# EAGLE design LCDv  (EAGLE 6.2)
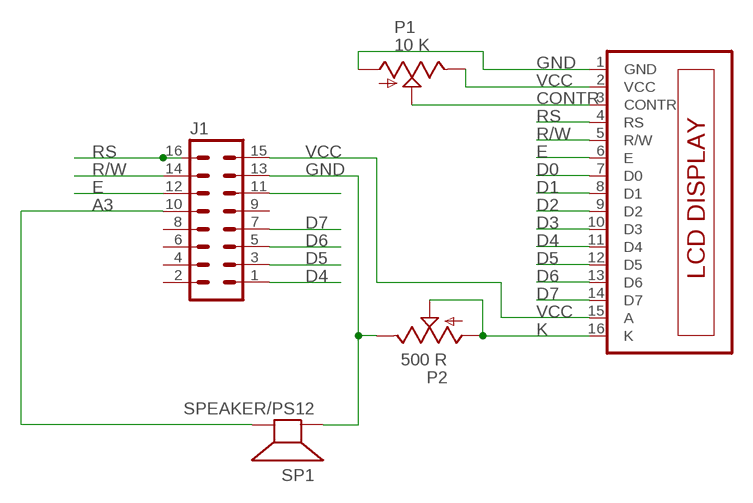
[diagram p0: schematic, sheet 1]

## Parts
J1  ML16L  [ML16L]
LCD1  DISP_LCD-4X20  [DISP_LCD_4X20]
P1  10 K  TRIM  [6MM]
P2  500 R  TRIM  [6MM]
SP1  SPEAKER/PS12  [PS12]

## Nets
A3: J1.10 SP1.P$2(-)
CONTR: LCD1.3(CONTR) P1.S
D0: LCD1.7(D0)
D1: LCD1.8(D1)
D2: LCD1.9(D2)
D3: LCD1.10(D3)
D4: J1.1 LCD1.11(D4)
D5: J1.3 LCD1.12(D5)
D6: J1.5 LCD1.13(D6)
D7: J1.7 LCD1.14(D7)
E: J1.12 LCD1.6(E)
GND: J1.13 LCD1.1(GND) P1.A P2.E SP1.P$1(+)
K: LCD1.16(K) P2.A P2.S
N$3: J1.11
R/W: J1.14 LCD1.5(R/W)
RS: J1.16 LCD1.4(RS)
VCC: J1.15 LCD1.2(VCC) LCD1.15(A) P1.E
Unconnected: J1.2 J1.4 J1.6 J1.8 J1.9

## Library data of the parts
J1 = con-harting-ml:ML16: HARTING; OC_FARNELL: unknown; OC_NEWARK: unknown
LCD1 = dp_devices:DISP_LCD
P1 P2 = adafruit:TRIM
SP1 = adafruit:SPEAKER: SPEAKER Source: Buerklin Added PS12 (for part # PS1240 piezo) http://www.ladyada.net/library/pcb/eaglelibrary.html

## Board
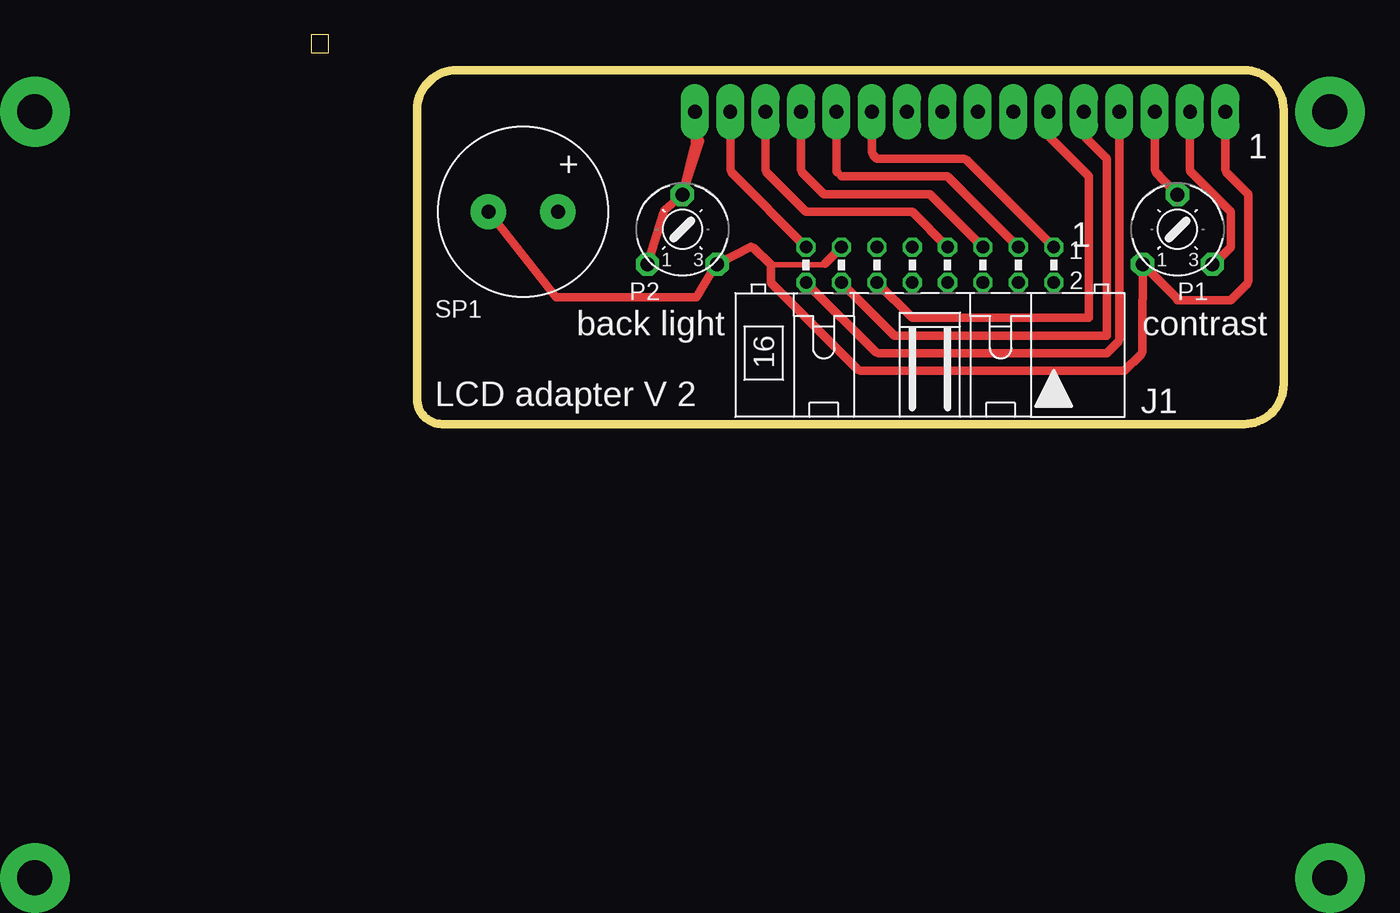
[diagram p1: board, top side]
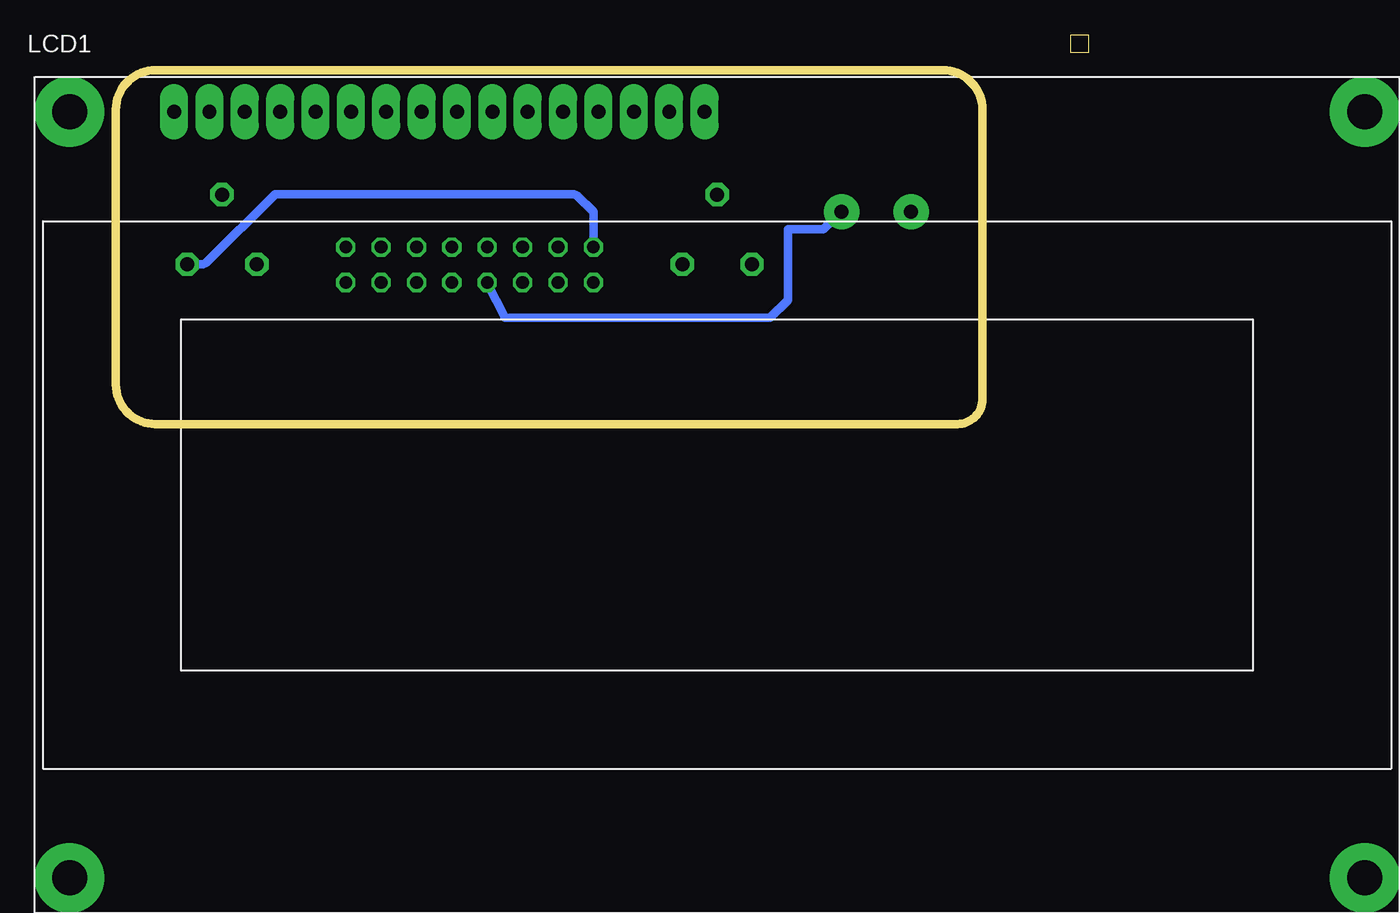
[diagram p2: board, bottom side, seen from below]

Size 69.85 x 27.94 mm. Coordinates in mm from the lower left corner, seen from the top.
Outline: 9.42,0 67.01,0 arc90 69.85,2.84 69.85,22.56 arc90 67.01,25.4 10.46,25.4 arc90 7.62,22.56 7.62,1.8 arc90 9.42,0
Copper layers (1*16): Top 0.0356mm / dielectric 1.5011mm / Bottom 0.0356mm
Design rules: minimum track width 6mil, minimum drill 13mil, track to track 6mil, track to pad 6mil, pad to pad 6mil, via to via 6mil, smd to smd 6mil, copper to edge 15mil, drill to drill 6mil, minimum pad ring 7mil, minimum via ring 7mil, stop-mask expansion 4mil, vias tented up to drill 0mil, thermal gap 10mil

### Footprints (pad centres in the part's own frame; a part is rotated, then mirrored left to right if it is on the bottom)
ML16L = drill 0.914 octagon: 1 -8.89,-1.27; 2 -8.89,1.27; 3 -6.35,-1.27; 4 -6.35,1.27; 5 -3.81,-1.27; 6 -3.81,1.27; 7 -1.27,-1.27; 8 -1.27,1.27; 9 1.27,-1.27; 10 1.27,1.27; 11 3.81,-1.27; 12 3.81,1.27; 13 6.35,-1.27; 14 6.35,1.27; 15 8.89,-1.27; 16 8.89,1.27
DISP_LCD_4X20 = drill 1 pad 2 long: 1 -39,27.5; 2 -36.46,27.5; 3 -33.92,27.5; 4 -31.38,27.5; 5 -28.84,27.5; 6 -26.3,27.5; 7 -23.76,27.5; 8 -21.22,27.5; 9 -18.68,27.5; 10 -16.14,27.5; 11 -13.6,27.5; 12 -11.06,27.5; 13 -8.52,27.5; 14 -5.98,27.5; 15 -3.44,27.5; 16 -0.9,27.5 | drill 2.5 pad 5: P$1 -46.5,27.5; P$2 -46.5,-27.5; P$3 46.5,27.5; P$4 46.5,-27.5
6MM = drill 1 pad 1.676 octagon: A -2.5,-2.5; E 2.5,-2.5; S 0,2.5
PS12 = drill 1 pad 2.54: P$1 -2.5,0; P$2 2.5,0

### Placement (x,y rotation side)
J1  44.45,11.43 180 top
LCD1  26.67,-5.08 0 bottom
P1  62.23,13.97 0 top
P2  26.67,13.97 0 top
SP1  15.24,15.24 0 top

### Tracks (layer width: path | path; a pad name or v marks a point on that pad's centre or on a via)
A3
  Bottom 0.152: 17.78,15.24 SP1.P$2
  Bottom 0.61: J1.10 41.91,7.62 22.86,7.62 21.59,8.89 21.59,13.97 19.05,13.97 17.78,15.24
CONTR
  Top 0.152: 60.59,18.26 arc45 60.66,18.08 | 60.96,17.78 arc45 60.99,17.71
  Top 0.61: LCD1.3 60.59,18.26 | 60.66,18.08 60.96,17.78 | 60.99,17.71 P1.S
D4
  Top 0.152: 40.27,19.53 arc45 40.34,19.35 | 46.89,19.05 arc-45 47.06,18.98
  Top 0.61: LCD1.11 40.27,19.53 | 40.34,19.35 40.64,19.05 46.89,19.05 | 47.06,18.98 J1.1
D5
  Top 0.152: 37.8,18.08 38.1,17.78
  Top 0.61: LCD1.12 37.73,18.26 arc45 37.8,18.08 | 38.1,17.78 45.72,17.78 J1.3
D6
  Top 0.152: 35.19,18.26 arc45 35.26,18.08
  Top 0.61: LCD1.13 35.19,18.26 | 35.26,18.08 36.83,16.51 44.45,16.51 J1.5
D7
  Top 0.152: 32.65,18.26 arc45 32.72,18.08
  Top 0.61: LCD1.14 32.65,18.26 | 32.72,18.08 35.56,15.24 43.18,15.24 J1.7
E
  Top 0.152: 52.97,20.8 arc45 53.04,20.62
  Top 0.61: LCD1.6 52.97,20.8 | 53.04,20.62 55.88,17.78 55.88,7.62 43.18,7.62 J1.12
GND
  Top 0.152: 65.67,18.26 arc45 65.74,18.08 | 67.31,10.27 arc-45 67.24,10.09 | 62.23,8.89 arc45 62.17,9.03 | 59.73,8.99 arc-45 59.69,8.89 | 59.69,5.19 arc-45 59.62,5.01 | 39.48,3.81 arc-45 39.3,3.88 | 36.73,11.43 arc45 36.9,11.5 | 31.61,12.74 arc-45 31.78,12.67 | 12.8,15.19 SP1.P$1 | 28.96,11.23 P2.E
  Top 0.406: 36.73,11.43 33.02,11.43
  Top 0.61: LCD1.1 65.67,18.26 | 65.74,18.08 67.31,16.51 67.31,10.27 | 67.24,10.09 66.04,8.89 62.23,8.89 | 62.17,9.03 P1.A 59.73,8.99 | 59.69,8.89 59.69,5.19 | 59.62,5.01 58.42,3.81 39.48,3.81 | 39.3,3.88 33.02,10.16 33.02,11.43 31.78,12.67 | P2.E 31.61,12.74 | 36.9,11.5 J1.13 | 12.8,15.19 17.6,9.12 27.69,9.12 28.96,11.23
K
  Top 0.152: 25.4,15.35 arc-45 25.33,15.17 | P2.S 26.67,16.51
  Top 0.61: LCD1.16 27.57,20.02 arc-45 27.5,19.84 P2.S 25.4,15.35 | 25.33,15.17 P2.A | 27.9,20.36 27.94,20.32 26.67,16.51
R/W
  Top 0.152: 55.51,20.8 arc45 55.58,20.62
  Top 0.61: LCD1.5 55.51,20.8 | 55.58,20.62 57.15,19.05 57.15,6.35 41.91,6.35 J1.14
RS
  Top 0.152: 58.05,6.09 arc-45 57.98,5.91 | 40.74,5.08 arc-45 40.57,5.15
  Top 0.61: 57.98,5.91 57.15,5.08 40.74,5.08 | 40.57,5.15 J1.16 | LCD1.4 58.05,6.09
VCC
  Top 0.152: 30.11,18.26 arc45 30.18,18.08 | 64.82,11.48 64.77,11.53 P1.E
  Top 0.61: LCD1.2 63.13,18.26 arc45 63.2,18.08 66.04,15.24 66.04,12.7 64.82,11.48 64.77,11.43 | LCD1.15 30.11,18.26 | 30.18,18.08 J1.15
  Bottom 0.152: 36.76,16.44 arc-45 36.94,16.51 | 63.39,11.54 arc45 63.56,11.47
  Bottom 0.61: J1.15 35.56,15.24 36.76,16.44 | 36.94,16.51 58.42,16.51 63.39,11.54 | 63.56,11.47 P1.E

### Text on the board
tNames: 1 | + | 1 | back light | contrast | LCD adapter V 2